# EAGLE design BarGraph (EAGLE 7.5.0)
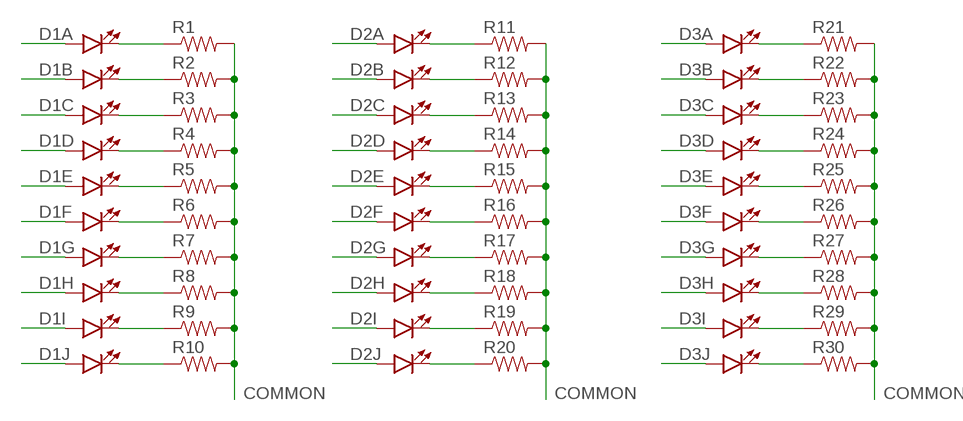
[diagram p0: schematic, sheet 1]

## Parts
D1  LED_BARGRAPH_10  [LED_BARGAPH_10]
D2  LED_BARGRAPH_10  [LED_BARGAPH_10]
D3  LED_BARGRAPH_10  [LED_BARGAPH_10]
R1  RESISTORPTH-1/4W  [AXIAL-0.4]
R2  RESISTORPTH-1/4W  [AXIAL-0.4]
R3  RESISTORPTH-1/4W  [AXIAL-0.4]
R4  RESISTORPTH-1/4W  [AXIAL-0.4]
R5  RESISTORPTH-1/4W  [AXIAL-0.4]
R6  RESISTORPTH-1/4W  [AXIAL-0.4]
R7  RESISTORPTH-1/4W  [AXIAL-0.4]
R8  RESISTORPTH-1/4W  [AXIAL-0.4]
R9  RESISTORPTH-1/4W  [AXIAL-0.4]
R10  RESISTORPTH-1/4W  [AXIAL-0.4]
R11  RESISTORPTH-1/4W  [AXIAL-0.4]
R12  RESISTORPTH-1/4W  [AXIAL-0.4]
R13  RESISTORPTH-1/4W  [AXIAL-0.4]
R14  RESISTORPTH-1/4W  [AXIAL-0.4]
R15  RESISTORPTH-1/4W  [AXIAL-0.4]
R16  RESISTORPTH-1/4W  [AXIAL-0.4]
R17  RESISTORPTH-1/4W  [AXIAL-0.4]
R18  RESISTORPTH-1/4W  [AXIAL-0.4]
R19  RESISTORPTH-1/4W  [AXIAL-0.4]
R20  RESISTORPTH-1/4W  [AXIAL-0.4]
R21  RESISTORPTH-1/4W  [AXIAL-0.4]
R22  RESISTORPTH-1/4W  [AXIAL-0.4]
R23  RESISTORPTH-1/4W  [AXIAL-0.4]
R24  RESISTORPTH-1/4W  [AXIAL-0.4]
R25  RESISTORPTH-1/4W  [AXIAL-0.4]
R26  RESISTORPTH-1/4W  [AXIAL-0.4]
R27  RESISTORPTH-1/4W  [AXIAL-0.4]
R28  RESISTORPTH-1/4W  [AXIAL-0.4]
R29  RESISTORPTH-1/4W  [AXIAL-0.4]
R30  RESISTORPTH-1/4W  [AXIAL-0.4]

## Nets
COMMON: R1.P$2 R2.P$2 R3.P$2 R4.P$2 R5.P$2 R6.P$2 R7.P$2 R8.P$2 R9.P$2 R10.P$2 R11.P$2 R12.P$2 R13.P$2 R14.P$2 R15.P$2 R16.P$2 R17.P$2 R18.P$2 R19.P$2 R20.P$2 R21.P$2 R22.P$2 R23.P$2 R24.P$2 R25.P$2 R26.P$2 R27.P$2 R28.P$2 R29.P$2 R30.P$2
N$1: D1.20(A:C) R1.P$1
N$2: D1.19(B:C) R2.P$1
N$3: D1.18(C:C) R3.P$1
N$4: D1.17(D:C) R4.P$1
N$5: D1.16(E:C) R5.P$1
N$6: D1.15(F:C) R6.P$1
N$7: D1.14(G:C) R7.P$1
N$8: D1.13(H:C) R8.P$1
N$9: D1.12(I:C) R9.P$1
N$10: D1.11(J:C) R10.P$1
N$11: D1.1(A:A)
N$12: D1.2(B:A)
N$13: D1.3(C:A)
N$14: D1.4(D:A)
N$15: D1.5(E:A)
N$16: D1.6(F:A)
N$17: D1.7(G:A)
N$18: D1.8(H:A)
N$19: D1.9(I:A)
N$20: D1.10(J:A)
N$21: D2.20(A:C) R11.P$1
N$22: D2.19(B:C) R12.P$1
N$23: D2.18(C:C) R13.P$1
N$24: D2.17(D:C) R14.P$1
N$25: D2.16(E:C) R15.P$1
N$26: D2.15(F:C) R16.P$1
N$27: D2.14(G:C) R17.P$1
N$28: D2.13(H:C) R18.P$1
N$29: D2.12(I:C) R19.P$1
N$30: D2.11(J:C) R20.P$1
N$31: D2.1(A:A)
N$32: D2.2(B:A)
N$33: D2.3(C:A)
N$34: D2.4(D:A)
N$35: D2.5(E:A)
N$36: D2.6(F:A)
N$37: D2.7(G:A)
N$38: D2.8(H:A)
N$39: D2.9(I:A)
N$40: D2.10(J:A)
N$41: D3.20(A:C) R21.P$1
N$42: D3.19(B:C) R22.P$1
N$43: D3.18(C:C) R23.P$1
N$44: D3.17(D:C) R24.P$1
N$45: D3.16(E:C) R25.P$1
N$46: D3.15(F:C) R26.P$1
N$47: D3.14(G:C) R27.P$1
N$48: D3.13(H:C) R28.P$1
N$49: D3.12(I:C) R29.P$1
N$50: D3.11(J:C) R30.P$1
N$51: D3.1(A:A)
N$52: D3.2(B:A)
N$53: D3.3(C:A)
N$54: D3.4(D:A)
N$55: D3.5(E:A)
N$56: D3.6(F:A)
N$57: D3.7(G:A)
N$58: D3.8(H:A)
N$59: D3.9(I:A)
N$60: D3.10(J:A)

## Library data of the parts
D1-D3 = SparkFun-LED:LED_BARGRAPH_10: 10-Segment LED Bar Graph SFE part numbers: COM-09935 (red, Vf = 2.1V, Ifmax = 20mA) COM-09936 (yellow, Vf = 2.1V, Ifmax = 20mA) COM-09937 (blue, Vf = 3.4V, Ifmax = 20mA) COM-09938 (green, Vf = 3.4V, Ifmax = 20mA)
R1-R30 = SparkFun-Passives:RESISTOR: Resistor Basic schematic elements and footprints for 0603, 1206, and PTH resistors.

## Board
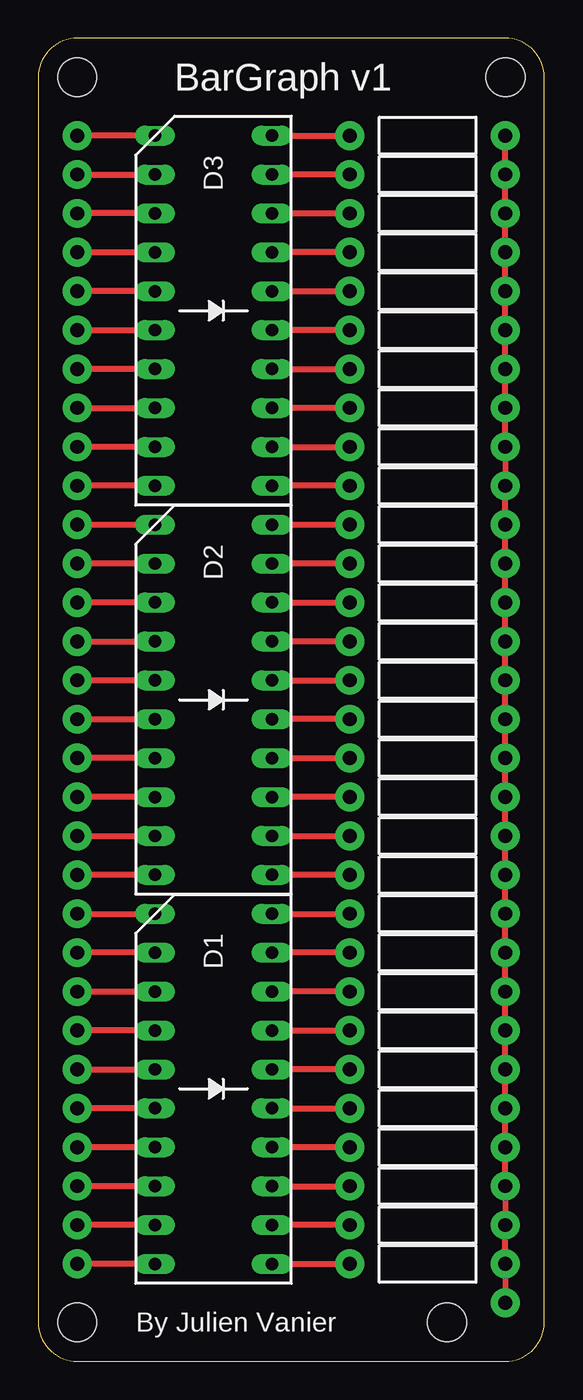
[diagram p1: board, top side]

Size 33.02 x 86.36 mm. Coordinates in mm from the lower left corner, seen from the top.
Outline: 0,83.82 0,2.54 arc90 2.54,0 30.48,0 arc90 33.02,2.54 33.02,83.82 arc90 30.48,86.36 2.54,86.36 arc90 0,83.82
Copper layers (1*16): Top 0.035mm / dielectric 1.5mm / Bottom 0.035mm
Design rules "default": minimum track width 10mil, minimum drill 0.6mm, track to track 8mil, track to pad 8mil, pad to pad 8mil, via to via 8mil, smd to smd 8mil, copper to edge 40mil, drill to drill 8mil, minimum pad ring 10mil, minimum via ring 8mil, stop-mask expansion 4mil, vias tented up to drill 0mil, thermal gap 10mil
Holes 2.54 mm at 30.48,83.82 2.54,83.82 2.54,2.54 26.67,2.54

### Footprints (pad centres in the part's own frame; a part is rotated, then mirrored left to right if it is on the bottom)
LED_BARGAPH_10 = drill 0.813 long: 1 -11.43,-3.81; 2 -8.89,-3.81; 3 -6.35,-3.81; 4 -3.81,-3.81; 5 -1.27,-3.81; 6 1.27,-3.81; 7 3.81,-3.81; 8 6.35,-3.81; 9 8.89,-3.81; 10 11.43,-3.81; 11 11.43,3.81; 12 8.89,3.81; 13 6.35,3.81; 14 3.81,3.81; 15 1.27,3.81; 16 -1.27,3.81; 17 -3.81,3.81; 18 -6.35,3.81; 19 -8.89,3.81; 20 -11.43,3.81
AXIAL-0.4 = drill 0.9 pad 1.88: P$1 -5.08,0; P$2 5.08,0

### Placement (x,y rotation side)
D1  11.43,17.78 270 top
D2  11.43,43.18 270 top
D3  11.43,68.58 270 top
R1  25.4,29.21 0 top
R2  25.4,26.67 0 top
R3  25.4,24.13 0 top
R4  25.4,21.59 0 top
R5  25.4,19.05 0 top
R6  25.4,16.51 0 top
R7  25.4,13.97 0 top
R8  25.4,11.43 0 top
R9  25.4,8.89 0 top
R10  25.4,6.35 0 top
R11  25.4,54.61 0 top
R12  25.4,52.07 0 top
R13  25.4,49.53 0 top
R14  25.4,46.99 0 top
R15  25.4,44.45 0 top
R16  25.4,41.91 0 top
R17  25.4,39.37 0 top
R18  25.4,36.83 0 top
R19  25.4,34.29 0 top
R20  25.4,31.75 0 top
R21  25.4,80.01 0 top
R22  25.4,77.47 0 top
R23  25.4,74.93 0 top
R24  25.4,72.39 0 top
R25  25.4,69.85 0 top
R26  25.4,67.31 0 top
R27  25.4,64.77 0 top
R28  25.4,62.23 0 top
R29  25.4,59.69 0 top
R30  25.4,57.15 0 top

### Tracks (layer width: path | path; a pad name or v marks a point on that pad's centre or on a via)
COMMON  (via drill 0.9 pad 1.88)
  Top 0.406: R21.P$2 R22.P$2 R23.P$2 R24.P$2 R25.P$2 R26.P$2 R27.P$2 R28.P$2 R29.P$2 R30.P$2 R11.P$2 R12.P$2 R13.P$2 R14.P$2 R15.P$2 R16.P$2 R17.P$2 R18.P$2 R19.P$2 R20.P$2 R1.P$2 R2.P$2 R3.P$2 R4.P$2 R5.P$2 R6.P$2 R7.P$2 R8.P$2 R9.P$2 R10.P$2 v30.48,3.81
N$1
  Top 0.406: D1.20 R1.P$1
N$2
  Top 0.406: R2.P$1 D1.19
N$3
  Top 0.406: R3.P$1 D1.18
N$4
  Top 0.406: D1.17 R4.P$1
N$5
  Top 0.406: R5.P$1 D1.16
N$6
  Top 0.406: D1.15 R6.P$1
N$7
  Top 0.406: R7.P$1 D1.14
N$8
  Top 0.406: D1.13 R8.P$1
N$9
  Top 0.406: R9.P$1 D1.12
N$10
  Top 0.406: D1.11 R10.P$1
N$11  (via drill 0.9 pad 1.88)
  Top 0.406: v2.54,29.21 D1.1
N$12  (via drill 0.9 pad 1.88)
  Top 0.406: D1.2 v2.54,26.67
N$13  (via drill 0.9 pad 1.88)
  Top 0.406: v2.54,24.13 D1.3
N$14  (via drill 0.9 pad 1.88)
  Top 0.406: D1.4 v2.54,21.59
N$15  (via drill 0.9 pad 1.88)
  Top 0.406: v2.54,19.05 D1.5
N$16  (via drill 0.9 pad 1.88)
  Top 0.406: D1.6 v2.54,16.51
N$17  (via drill 0.9 pad 1.88)
  Top 0.406: D1.7 v2.54,13.97
N$18  (via drill 0.9 pad 1.88)
  Top 0.406: D1.8 v2.54,11.43
N$19  (via drill 0.9 pad 1.88)
  Top 0.406: D1.9 v2.54,8.89
N$20  (via drill 0.9 pad 1.88)
  Top 0.406: D1.10 v2.54,6.35
N$21
  Top 0.406: D2.20 R11.P$1
N$22
  Top 0.406: R12.P$1 D2.19
N$23
  Top 0.406: D2.18 R13.P$1
N$24
  Top 0.406: R14.P$1 D2.17
N$25
  Top 0.406: D2.16 R15.P$1
N$26
  Top 0.406: R16.P$1 D2.15
N$27
  Top 0.406: D2.14 R17.P$1
N$28
  Top 0.406: R18.P$1 D2.13
N$29
  Top 0.406: D2.12 R19.P$1
N$30
  Top 0.406: R20.P$1 D2.11
N$31  (via drill 0.9 pad 1.88)
  Top 0.406: v2.54,54.61 D2.1
N$32  (via drill 0.9 pad 1.88)
  Top 0.406: D2.2 v2.54,52.07
N$33  (via drill 0.9 pad 1.88)
  Top 0.406: D2.3 v2.54,49.53
N$34  (via drill 0.9 pad 1.88)
  Top 0.406: v2.54,46.99 D2.4
N$35  (via drill 0.9 pad 1.88)
  Top 0.406: D2.5 v2.54,44.45
N$36  (via drill 0.9 pad 1.88)
  Top 0.406: v2.54,41.91 D2.6
N$37  (via drill 0.9 pad 1.88)
  Top 0.406: D2.7 v2.54,39.37
N$38  (via drill 0.9 pad 1.88)
  Top 0.406: D2.8 v2.54,36.83
N$39  (via drill 0.9 pad 1.88)
  Top 0.406: v2.54,34.29 D2.9
N$40  (via drill 0.9 pad 1.88)
  Top 0.406: D2.10 v2.54,31.75
N$41
  Top 0.406: D3.20 R21.P$1
N$42
  Top 0.406: R22.P$1 D3.19
N$43
  Top 0.406: D3.18 R23.P$1
N$44
  Top 0.406: R24.P$1 D3.17
N$45
  Top 0.406: D3.16 R25.P$1
N$46
  Top 0.406: R26.P$1 D3.15
N$47
  Top 0.406: D3.14 R27.P$1
N$48
  Top 0.406: R28.P$1 D3.13
N$49
  Top 0.406: D3.12 R29.P$1
N$50
  Top 0.406: R30.P$1 D3.11
N$51  (via drill 0.9 pad 1.88)
  Top 0.406: D3.1 v2.54,80.01
N$52  (via drill 0.9 pad 1.88)
  Top 0.406: v2.54,77.47 D3.2
N$53  (via drill 0.9 pad 1.88)
  Top 0.406: D3.3 v2.54,74.93
N$54  (via drill 0.9 pad 1.88)
  Top 0.406: v2.54,72.39 D3.4
N$55  (via drill 0.9 pad 1.88)
  Top 0.406: D3.5 v2.54,69.85
N$56  (via drill 0.9 pad 1.88)
  Top 0.406: v2.54,67.31 D3.6
N$57  (via drill 0.9 pad 1.88)
  Top 0.406: D3.7 v2.54,64.77
N$58  (via drill 0.9 pad 1.88)
  Top 0.406: v2.54,62.23 D3.8
N$59  (via drill 0.9 pad 1.88)
  Top 0.406: D3.9 v2.54,59.69
N$60  (via drill 0.9 pad 1.88)
  Top 0.406: D3.10 v2.54,57.15

### Text on the board
tPlace: BarGraph v1 | By Julien Vanier